# Altium schematic sheet RSD_M1_HELMET_UNIT_MCU_V2.SchDoc
size A3
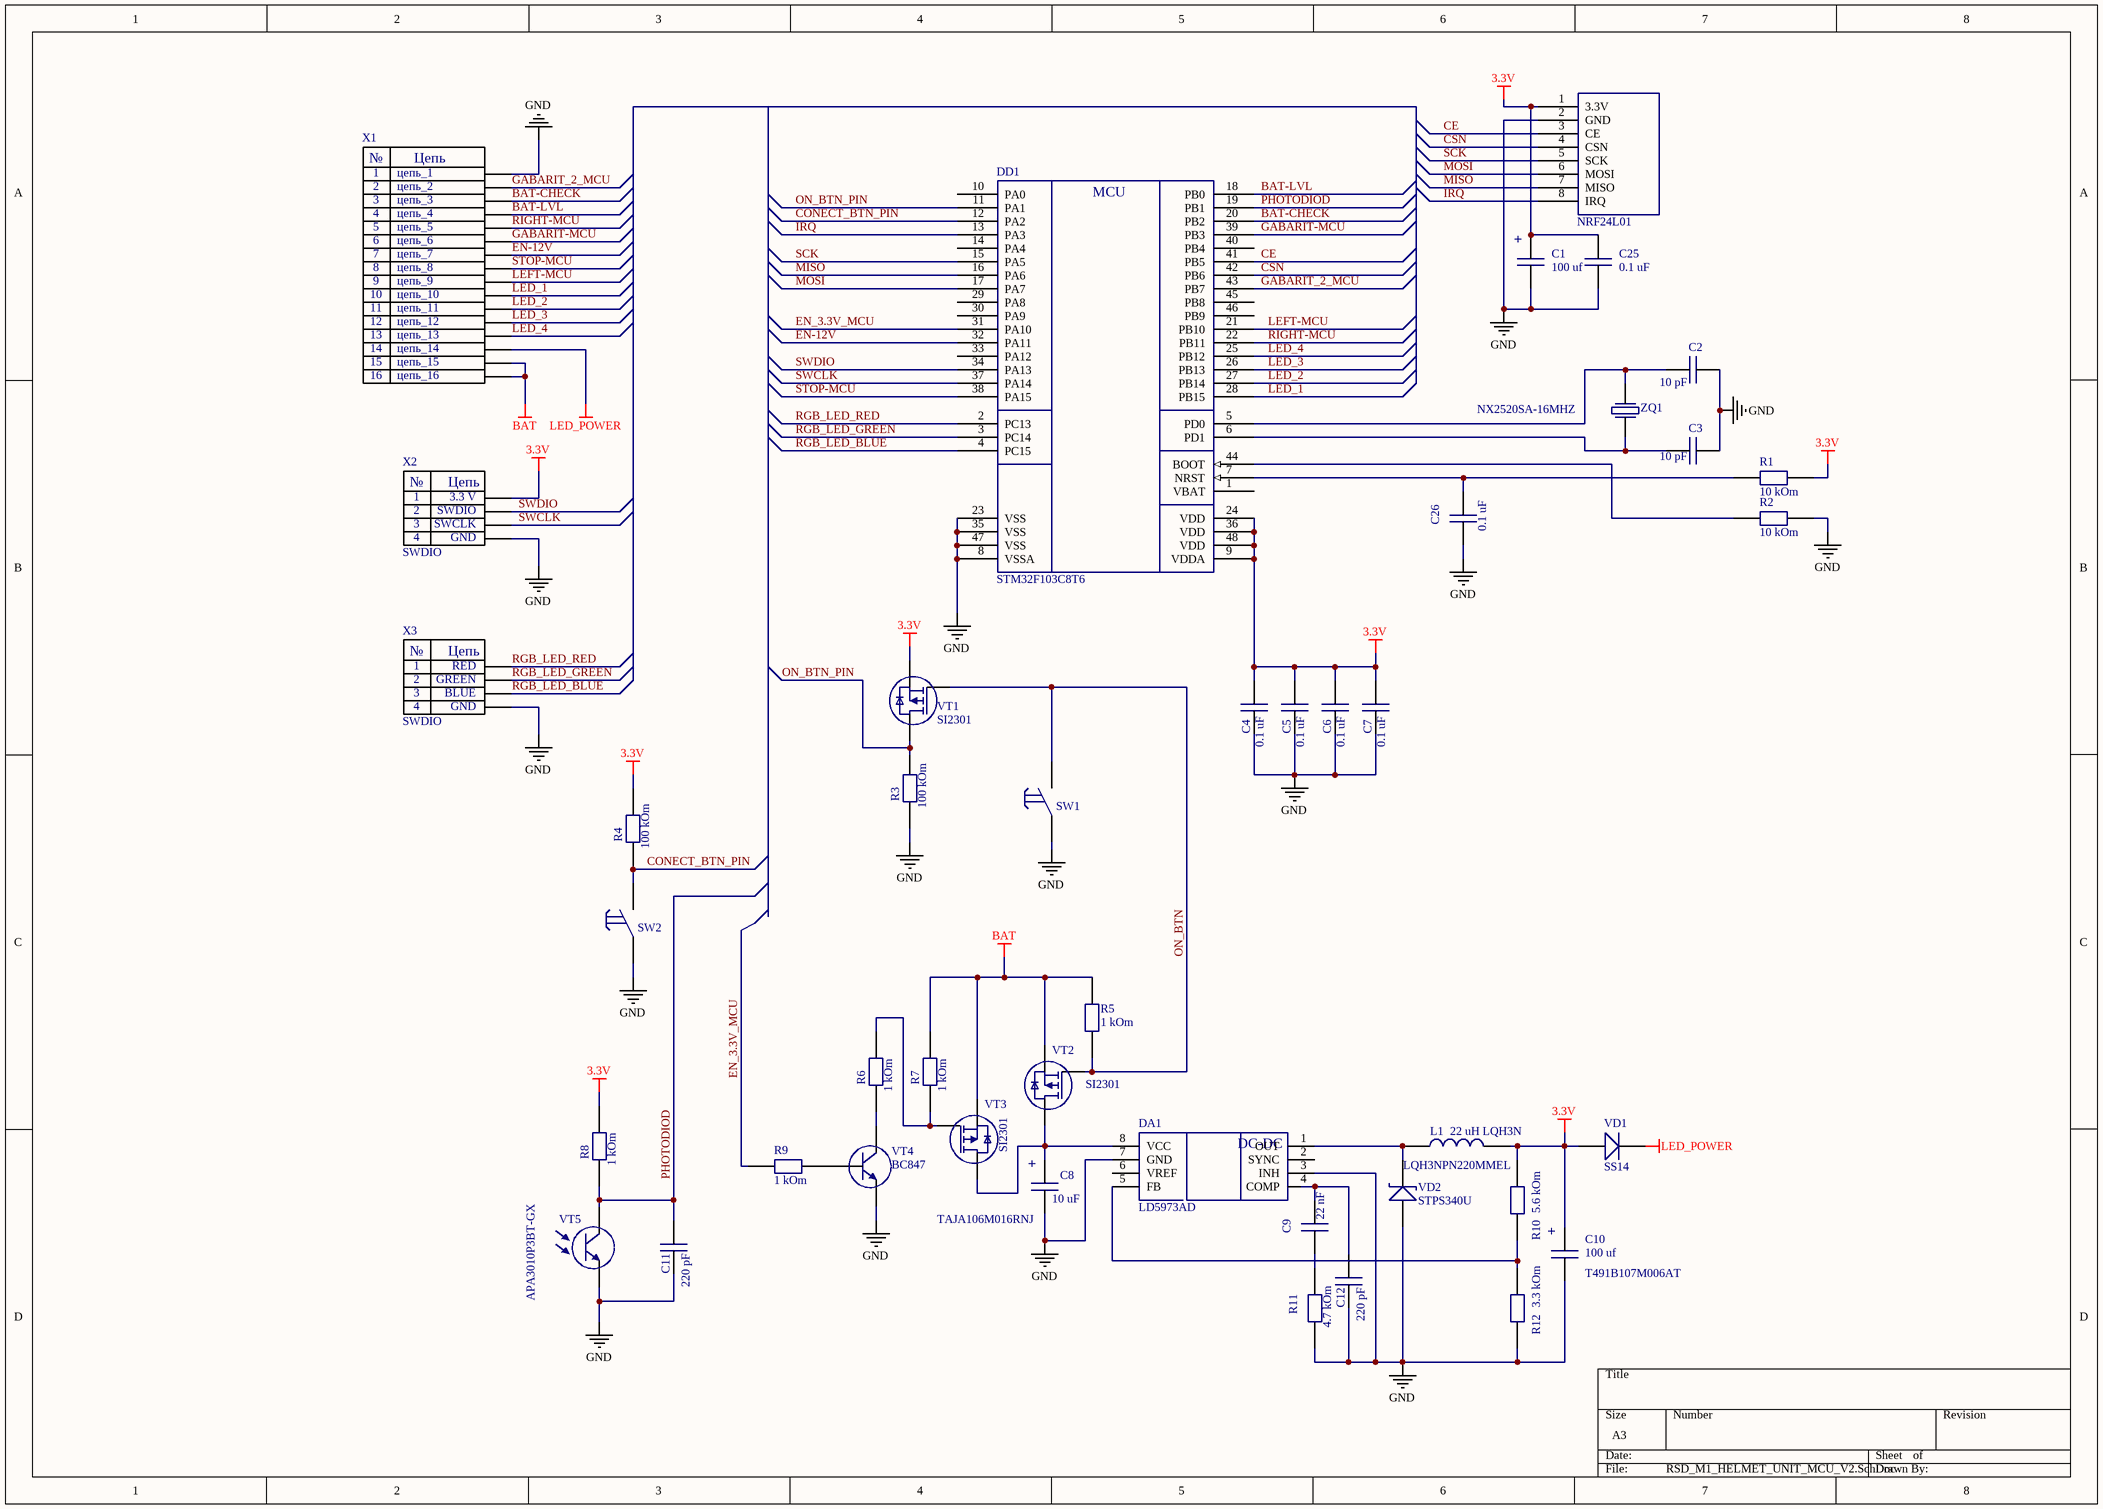
[diagram p0: RSD_M1_HELMET_UNIT_MCU_V2.SchDoc]

## Parts
C1  100 uf  [tantal_case_B]
C2  value 10 pF  [CAP0603]  (hidden comment: Capacitor)
C3  value 10 pF  [CAP0603]  (hidden comment: Capacitor)
C4  value 0.1 uF  [CAP0603]  (hidden comment: Capacitor)
C5  value 0.1 uF  [CAP0603]  (hidden comment: Capacitor)
C6  value 0.1 uF  [CAP0603]  (hidden comment: Capacitor)
C7  value 0.1 uF  [CAP0603]  (hidden comment: Capacitor)
C8  10 uF  value TAJA106M016RNJ  [tantal_case_A]
C9  value 22 nF  [CAP0603]  (hidden comment: Capacitor)
C10  100 uf  value T491B107M006AT  [tantal_case_B]
C11  value 220 pF  [CAP0603]  (hidden comment: Capacitor)
C12  value 220 pF  [CAP0603]  (hidden comment: Capacitor)
C25  value 0.1 uF  [CAP0603]  (hidden comment: Capacitor)
C26  value 0.1 uF  [CAP0603]  (hidden comment: Capacitor)
DA1  LD5973AD  [SOIC-8]
DD1  value STM32F103C8T6  [STM32F103C8T6]  (hidden comment: STM32F103C8Tx)
L1  value 22 uH LQH3N  PN: LQH3NPN220MMEL  [LQH3N]  (hidden comment: coil)
NRF1  NRF24L01  [NRF24L01]
R1  value 10 kOm  [Res0603]  (hidden comment: Resistor)
R2  value 10 kOm  [Res0603]  (hidden comment: Resistor)
R3  value 100 kOm  [Res0603]  (hidden comment: Resistor)
R4  value 100 kOm  [Res0603]  (hidden comment: Resistor)
R5  value 1 kOm  [Res0603]  (hidden comment: Resistor)
R6  value 1 kOm  [Res0603]  (hidden comment: Resistor)
R7  value 1 kOm  [Res0603]  (hidden comment: Resistor)
R8  value 1 kOm  [Res0603]  (hidden comment: Resistor)
R9  value 1 kOm  [Res0603]  (hidden comment: Resistor)
R10  value 5.6 kOm  [Res0603]  (hidden comment: Resistor)
R11  value 4.7 kOm  [Res0603]  (hidden comment: Resistor)
R12  value 3.3 kOm  [Res0603]  (hidden comment: Resistor)
SW1  tact_switch  [tact_switch]  (value not drawn)
SW2  tact_switch  [tact_switch]  (value not drawn)
VD1  value SS14  [SMA-F]  (hidden comment: Diode)
VD2  value STPS340U  [SMB1]  (hidden comment: Schottky)
VT1  value SI2301  [SOT 23]  (hidden comment: MOSFET-P)
VT2  value SI2301  [SOT 23]  (hidden comment: MOSFET-P)
VT3  value SI2301  [SOT 23]  (hidden comment: MOSFET-P)
VT4  value BC847  [SOT 23]  (hidden comment: NPN)
VT5  value APA3010P3BT-GX  [LED0805]  (hidden comment: Phototransistor)
X1  16: цепь_16  1: цепь_1  2: цепь_2  3: цепь_3  4: цепь_4  5: цепь_5  6: цепь_6  7: цепь_7  8: цепь_8  9: цепь_9  10: цепь_10  11: цепь_11  12: цепь_12  13: цепь_13  14: цепь_14  15: цепь_15  [FPC_16_0.5]  (hidden comment: FPC_connector_16)
X2  SWDIO  1: 3.3 V  3: SWCLK  4: GND  [SWDIO]
X3  SWDIO  1: RED  2: GREEN  3: BLUE  4: GND  [SWDIO]
ZQ1  value NX2520SA-16MHZ  [crystal]  (hidden comment: Qartz)

## Nets
3.3V: C1.1 C4.2 C5.2 C6.2 C7.2 C10.1 C25.2 DD1.9(VDDA) DD1.24(VDD) DD1.36(VDD) DD1.48(VDD) L1.2 NRF1.1(3.3V) R1.2 R4.1 R8.2 R10.1 VD1.2 VT1.S X2.1
BAT: R5.2 R7.2 VT2.S VT3.S X1.15 X1.16
GND: C1.2 C2.1 C3.1 C4.1 C5.1 C6.1 C7.1 C8.2 C10.2 C11.1 C12.1 C25.1 C26.1 DA1.3(INH) DA1.7(GND) DD1.8(VSSA) DD1.23(VSS) DD1.35(VSS) DD1.47(VSS) NRF1.2(GND) R2.2 R3.2 R11.2 R12.2 SW1.1 SW2.1 VD2.2 VT4.E VT5.2 X1.1 X2.4 X3.4
LED_POWER: VD1.1 X1.14
BAT-CHECK: DD1.20(PB2) X1.3
BAT-LVL: DD1.18(PB0) X1.4
CE: DD1.41(PB5) NRF1.3(CE)
CONECT_BTN_PIN: DD1.12(PA2) R4.2 SW2.2
CSN: DD1.42(PB6) NRF1.4(CSN)
EN-12V: DD1.32(PA11) X1.7
EN_3.3V_MCU: DD1.31(PA10) R9.2
GABARIT-MCU: DD1.39(PB3) X1.6
GABARIT_2_MCU: DD1.43(PB7) X1.2
IRQ: DD1.13(PA3) NRF1.8(IRQ)
LED_1: DD1.28(PB15) X1.10
LED_2: DD1.27(PB14) X1.11
LED_3: DD1.26(PB13) X1.12
LED_4: DD1.25(PB12) X1.13
LEFT-MCU: DD1.21(PB10) X1.9
MISO: DD1.16(PA6) NRF1.7(MISO)
MOSI: DD1.17(PA7) NRF1.6(MOSI)
ON_BTN: R5.1 SW1.2 VT1.G VT2.G
ON_BTN_PIN: DD1.11(PA1) R3.1 VT1.D
PHOTODIOD: C11.2 DD1.19(PB1) R8.1 VT5.1
RGB_LED_BLUE: DD1.4(PC15) X3.3
RGB_LED_GREEN: DD1.3(PC14) X3.2
RGB_LED_RED: DD1.2(PC13) X3.1
RIGHT-MCU: DD1.22(PB11) X1.5
SCK: DD1.15(PA5) NRF1.5(SCK)
STOP-MCU: DD1.38(PA15) X1.8
SWCLK: DD1.37(PA14) X2.3
SWDIO: DD1.34(PA13) X2.2
NetC2_2: C2.2 DD1.5(PD0) ZQ1.2
NetC3_2: C3.2 DD1.6(PD1) ZQ1.1
NetC8_1: C8.1 DA1.8(VCC) VT2.D VT3.D
NetC9_1: C9.1 R11.1
NetC9_2: C9.2 C12.2 DA1.4(COMP)
NetC26_2: C26.2 DD1.7(NRST) R1.1
NetDA1_1: DA1.1(OUT) L1.1 VD2.1
NetDA1_5: DA1.5(FB) R10.2 R12.1
NetDD1_44: DD1.44(BOOT) R2.1
NetR6_1: R6.1 VT4.K
NetR6_2: R6.2 R7.1 VT3.G
NetR9_1: R9.1 VT4.B

Not connected (* = marked no-connect by the designer): DA1 2(SYNC) 6(VREF); DD1 1(VBAT) 10(PA0) 14(PA4) 29(PA8) 30(PA9) 33(PA12) 40(PB4) 45(PB8) 46(PB9)

## Notes on the sheet
- (in symbol Capacitor_Polar) +
- (in symbol FPC_connector_16) №; Цепь
- (in symbol LD5973AD) DC-DC
- (in symbol STM32F103C8Tx) MCU
- (in symbol SWDIO) №; Цепь

## Library data of the parts
C1 = Capacitor_Polar: Value: T491B107M006AT
C8 C10 = Capacitor_Polar
SW1 SW2 = tact_switch: Value: TL3330AF260QG
VT1-VT3 = MOSFET-P: pin to pad: D>3 G>1 S>2
VT4 = NPN: pin to pad: B>1 E>2 K>3
X1 = FPC_connector_16: Value: 0527461671
DA1 = LD5973AD: Value: LD5973AD
X2 X3 = SWDIO
  X2: 2: SWDIO